# EAGLE design new_9DOF (EAGLE 7.1.0)
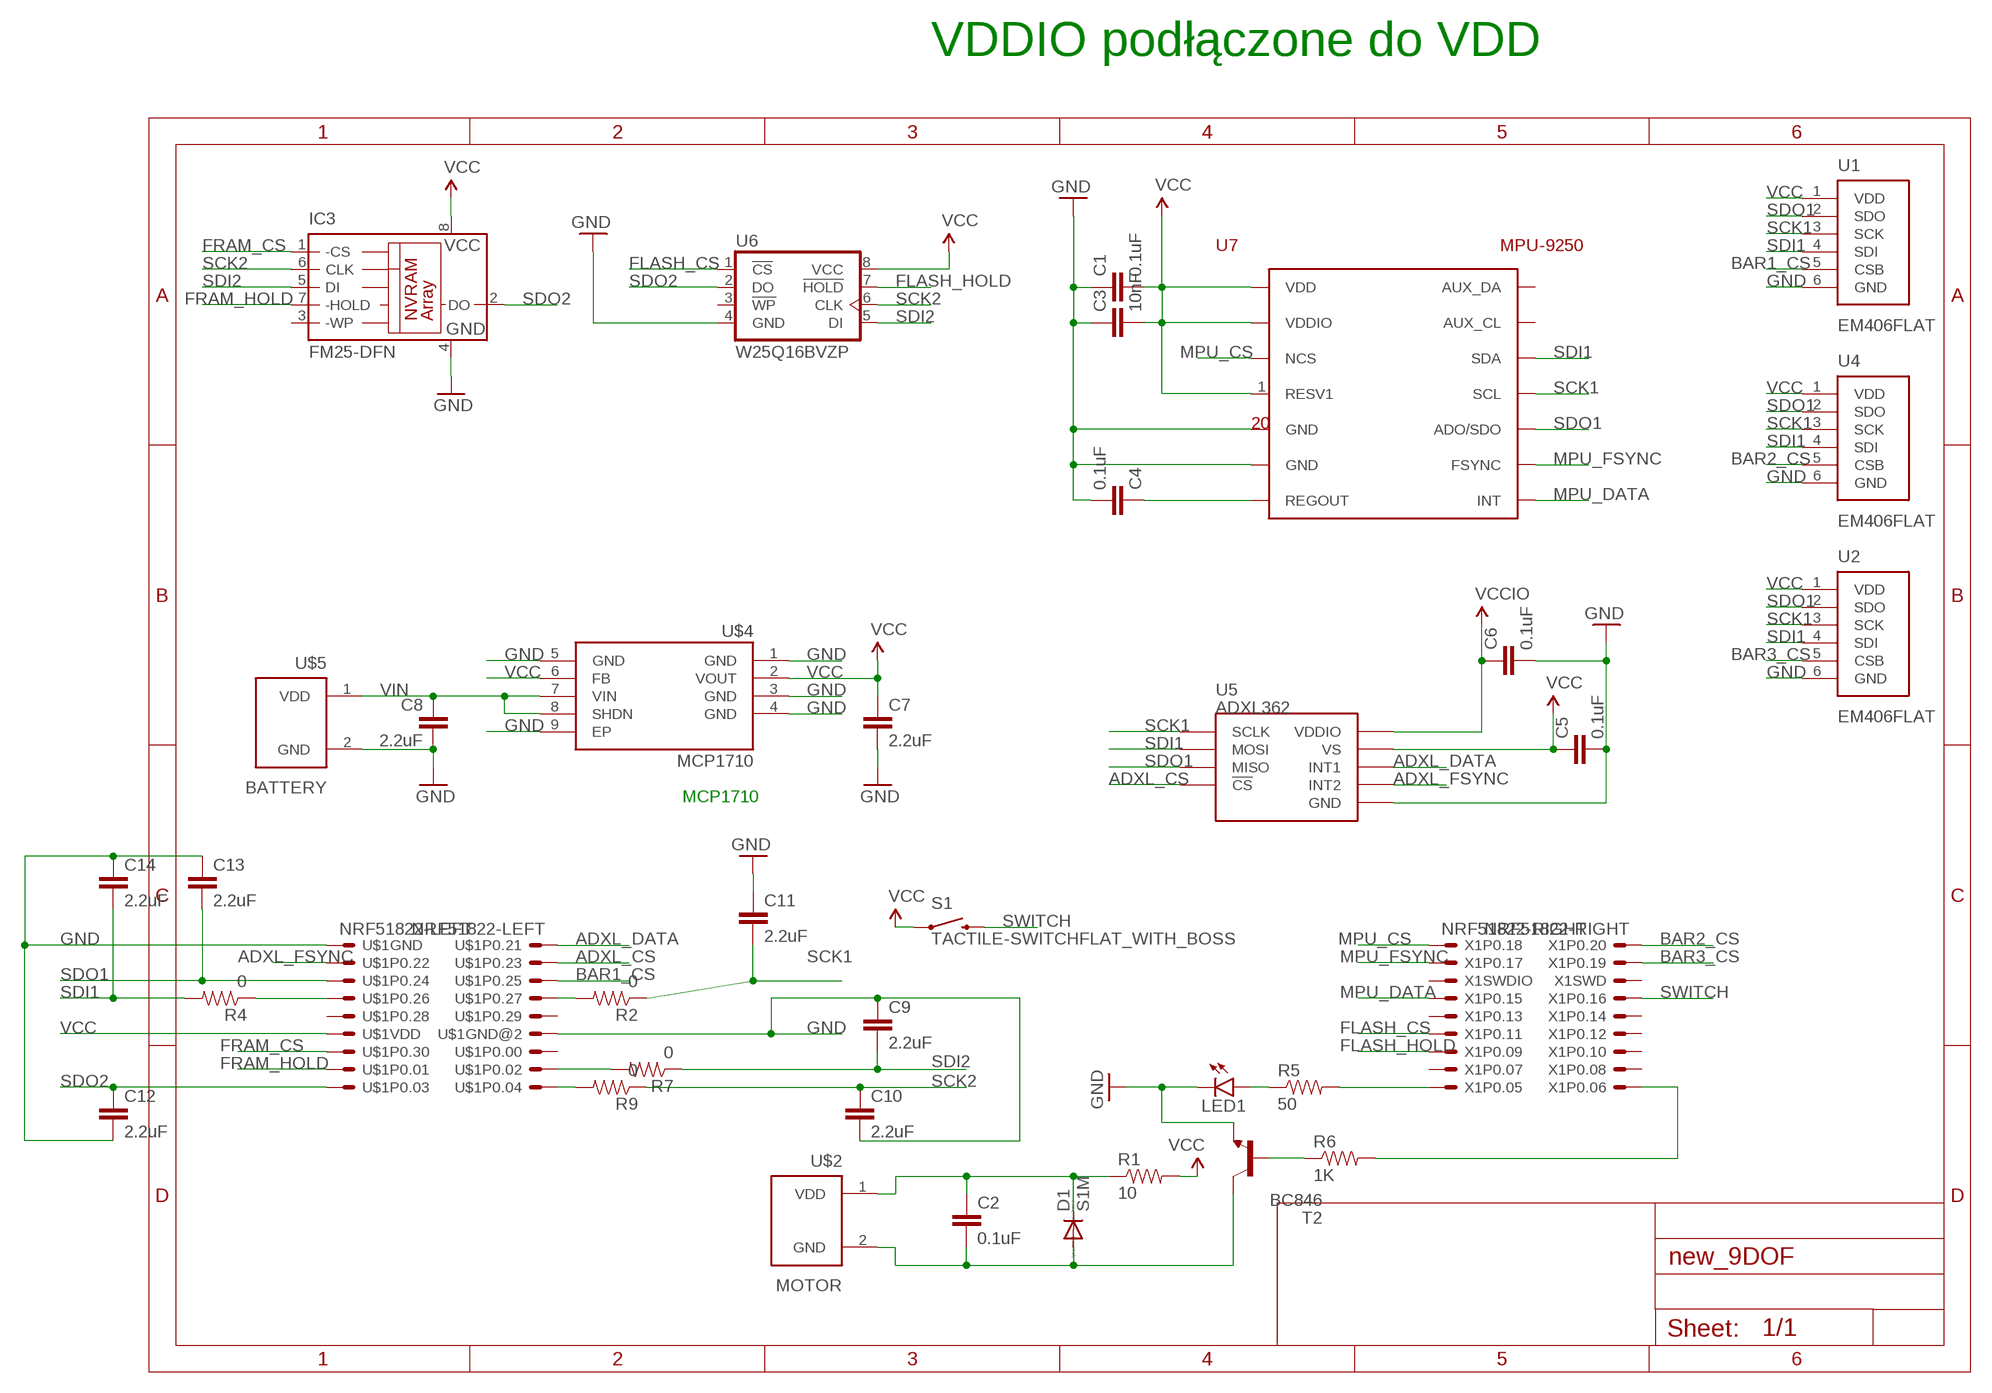
[diagram p0: schematic, sheet 1]

## Parts
C1  0.1uF  0.1UF-25V(+80/-20%)(0603)  [0603-CAP]
C2  0.1uF  0.1UF-25V(+80/-20%)(0603)  [0603-CAP]
C3  10nF  0.1UF-25V(+80/-20%)(0603)  [0603-CAP]
C4  0.1uF  0.1UF-25V(+80/-20%)(0603)  [0603-CAP]
C5  0.1uF  0.1UF-25V(+80/-20%)(0603)  [0603-CAP]
C6  0.1uF  0.1UF-25V(+80/-20%)(0603)  [0603-CAP]
C7  2.2uF  0.1UF-25V(+80/-20%)(0603)  [0603-CAP]
C8  2.2uF  0.1UF-25V(+80/-20%)(0603)  [0603-CAP]
C9  2.2uF  0.1UF-25V(+80/-20%)(0603)  [0603-CAP]
C10  2.2uF  0.1UF-25V(+80/-20%)(0603)  [0603-CAP]
C11  2.2uF  0.1UF-25V(+80/-20%)(0603)  [0603-CAP]
C12  2.2uF  0.1UF-25V(+80/-20%)(0603)  [0603-CAP]
C13  2.2uF  0.1UF-25V(+80/-20%)(0603)  [0603-CAP]
C14  2.2uF  0.1UF-25V(+80/-20%)(0603)  [0603-CAP]
D1  S1M  [SMA]
IC3  FM25-DFN  [DFN-8]
LED1  LED0603  [LED-0603]
R1  10  1KOHM1/10W1%(0603)  [0603-RES]
R2  0  100OHM1/10W1%(0603)  [0603-RES]
R4  0  100OHM1/10W1%(0603)  [0603-RES]
R5  50  100OHM1/10W1%(0603)  [0603-RES]
R6  1K  1KOHM1/10W1%(0603)  [0603-RES]
R7  0  100OHM1/10W1%(0603)  [0603-RES]
R9  0  100OHM1/10W1%(0603)  [0603-RES]
S1  TACTILE-SWITCHFLAT_WITH_BOSS  [TACTILE-SWITCH-SMD]
T2  BC846  [SOT23]
U1  EM406FLAT  [EM406-FLAT]
U2  EM406FLAT  [EM406-FLAT]
U4  EM406FLAT  [EM406-FLAT]
U5  ADXL362  ADXL362ADXL362-1:1  [ADXL362-1:1]
U6  W25Q16BVZP  [WSON8]
U7  MPU-9250  [MPU-9250]
U$1  NRF51822-LEFT  [NRF51822-LEFT]
U$2  MOTOR  EM406-2PINFLAT  [EM406-2PIN]
U$4  MCP1710  [MCP1710]
U$5  BATTERY  EM406-2PINFLAT  [EM406-2PIN]
X1  NRF51822-RIGHT  [NRF51822-RIGHT]

## Nets
ADXL_CS: U5.P$8(!CS) U$1.4
ADXL_DATA: U5.P$11(INT1) U$1.2
ADXL_FSYNC: U5.P$9(INT2) U$1.3
BAR1_CS: U1.5(CSB) U$1.6
BAR2_CS: U4.5(CSB) X1.2
BAR3_CS: U2.5(CSB) X1.4
FLASH_CS: U6.1(!CS!) X1.11
FLASH_HOLD: U6.7(!HOLD!) X1.13
FRAM_CS: IC3.1(-CS) U$1.13
FRAM_HOLD: IC3.7(-HOLD) U$1.15
GND: C1.1 C3.1 C4.2 C5.2 C6.2 C7.2 C8.2 C9.1 C10.2 C11.1 C12.2 C13.1 C14.1 IC3.4(GND) LED1.C T2.2(E) U1.6(GND) U2.6(GND) U4.6(GND) U5.P$12(GND) U5.P$13(GND) U5.P$16(GND) U6.4(GND) U7.18(GND) U7.20(GND) U$1.1 U$1.12 U$4.1(GND) U$4.3(GND) U$4.4(GND) U$4.5(GND) U$4.9(EP) U$5.2(GND)
MPU_CS: U7.22(NCS) X1.1
MPU_DATA: U7.12(INT) X1.7
MPU_FSYNC: U7.11(FSYNC) X1.3
N$1: C4.1 U7.10(REGOUT)
N$2: C2.1 D1.C R1.1 U$2.1(VDD)
N$3: R4.1 U$1.7
N$4: R2.2 U$1.8
N$5: R7.2 U$1.16
N$6: R5.2 X1.17
N$8: R9.2 U$1.18
N$13: LED1.A R5.1
N$14: C2.2 D1.A T2.3(C) U$2.2(GND)
N$15: R6.2 X1.18
N$16: R6.1 T2.1(B)
SCK1: C11.2 R2.1 U1.3(SCK) U2.3(SCK) U4.3(SCK) U5.P$4(SCLK) U7.23(SCL)
SCK2: C10.1 IC3.6(CLK) R9.1 U6.6(CLK)
SDI1: C14.2 R4.2 U1.4(SDI) U2.4(SDI) U4.4(SDI) U5.P$6(MOSI) U7.24(SDA)
SDI2: C9.2 IC3.5(DI) R7.1 U6.5(DI)
SDO1: C13.2 U1.2(SDO) U2.2(SDO) U4.2(SDO) U5.P$7(MISO) U7.9(ADO/SDO) U$1.5
SDO2: C12.1 IC3.2(DO) U6.2(DO) U$1.17
SWITCH: S1.2 X1.8
VCC: C1.2 C3.2 C5.1 C7.1 IC3.8(VCC) R1.2 S1.1 U1.1(VDD) U2.1(VDD) U4.1(VDD) U5.P$14(VS) U6.8(VCC) U7.1(RESV1) U7.8(VDDIO) U7.13(VDD) U$1.11 U$4.2(VOUT) U$4.6(FB)
VCCIO: C6.1 U5.P$1(VDDIO)
VIN: C8.1 U$4.7(VIN) U$4.8(SHDN) U$5.1(VDD)
Unconnected: IC3.3(-WP) U6.3(!WP!) U7.7(AUX_CL) U7.21(AUX_DA) U$1.9 U$1.10 U$1.14 X1.5 X1.6 X1.9 X1.10 X1.12 X1.14 X1.15 X1.16

## Notes on the sheet
- VDDIO podłączone do VDD
- MCP1710

## Library data of the parts
C1 C2 C4-C6 = SparkFun-Capacitors:0.1UF-25V(+80/-20%)(0603): CAP-00810 Ceramic Standard decoupling cap; PROD_ID: CAP-00810
C3 C7-C14 = SparkFun-Capacitors:0.1UF-25V(+80/-20%)(0603): CAP-00810 Ceramic Standard decoupling cap; PROD_ID: CAP-00810; VALUE: 0.1uF
D1 = icarus_sensors:S1M
IC3 = icarus_sensors:FM25*: SPI Serial NVRAM
LED1 = SparkFun-LED:LED: LEDs Standard schematic elements and footprints for 5mm, 3mm, 1206, and 0603 sized LEDs. 5mm - Spark Fun Electronics SKU : COM-00529 (and others)
R1 = SparkFun-Resistors:1KOHM1/10W1%(0603): RES-07856; PROD_ID: RES-07856; VALUE: 1K
R2 R4 R5 R7 R9 = SparkFun-Resistors:100OHM1/10W1%(0603): RES-07863; PROD_ID: RES-07863; VALUE: 100
R6 = SparkFun-Resistors:1KOHM1/10W1%(0603): RES-07856; PROD_ID: RES-07856
S1 = icarus_sensors:TACTILE-SWITCH: OMRON B3U-3000P(M)-B momentary switch
T2 = icarus_sensors:BC846: NPN TRANSISTOR
U1 U2 U4 = icarus_sensors:EM406: EM406 GPS Connector Proven layout and schematic for EM406 connector. Spark Fun Electronics SKU : GPS-00579
U5 = icarus_sensors:ADXL362: Micropower 3-axis accelerometer 2/4/8g digital output (SPI) IC-11297
U6 = icarus_sensors:W25Q16BV: EEPROM 4 Mbit SPI Serial Flash7
U7 = icarus_sensors:MPU-9250: The MPU-9250 is a 9-axis motion sensor that contains an accelerometer/gyro sensor (MPU-6500) combined with a magnetometer (AK8963).
U$1 = NRF51822_con_left:NRF51822-LEFT: left connector of NFR518822 board; MPN: NRF51822-left; OC_FARNELL: unknown; OC_NEWARK: 25M5675
U$2 U$5 = icarus_sensors:EM406-2PIN
U$4 = icarus_sensors:MCP1710: MCP1710 Ultra-Low Quiescent Current LDO Regulator 2x2mm
X1 = NRF51822_con_left:NRF51822-RIGHT: right connector of NFR518822 board; MPN: NRF51822-right; OC_FARNELL: unknown; OC_NEWARK: 25M5675

## Board
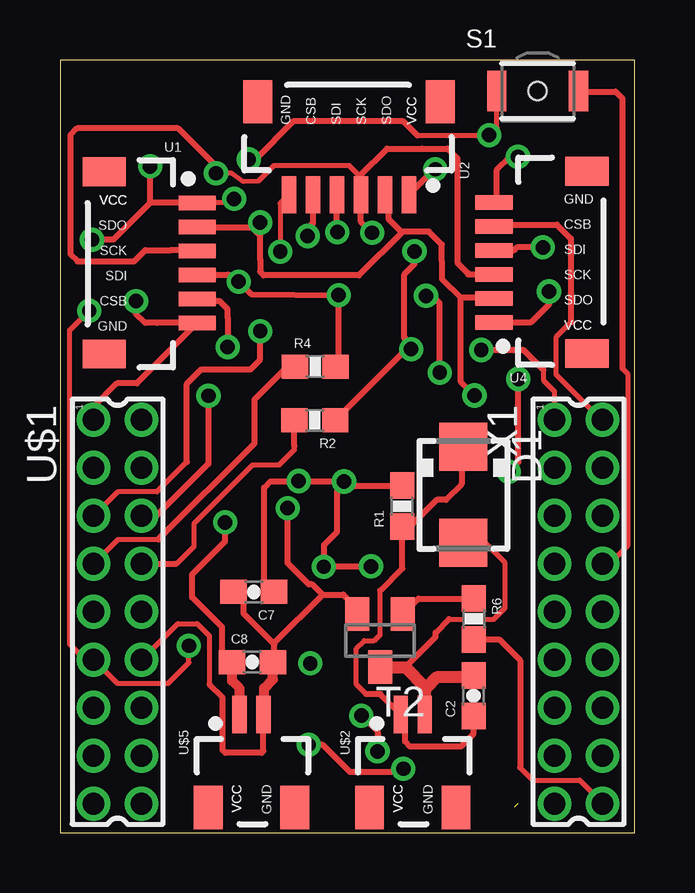
[diagram p1: board, top side]
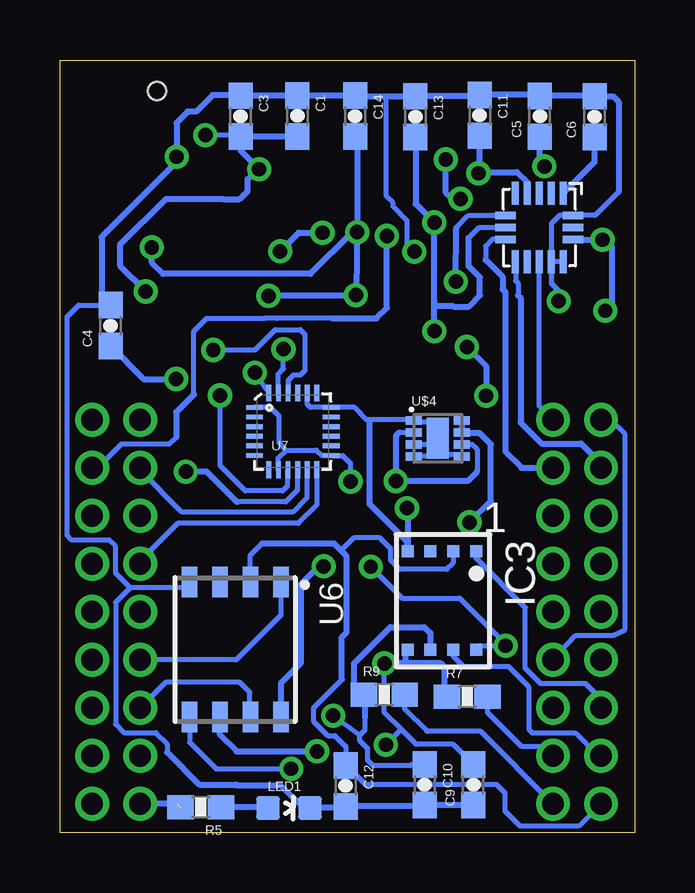
[diagram p2: board, bottom side, seen from below]

Size 23.94 x 32.19 mm. Coordinates in mm from the lower left corner, seen from the top.
Outline: 0,0 23.94,0 23.94,32.19 0,32.19 0,0
Copper layers (1*16): Top 0.035mm / dielectric 1.5mm / Bottom 0.035mm
Design rules "default": minimum track width 10mil, minimum drill 24mil, track to track 8mil, track to pad 8mil, pad to pad 8mil, via to via 8mil, smd to smd 8mil, copper to edge 40mil, drill to drill 8mil, minimum pad ring 10mil, minimum via ring 8mil, stop-mask expansion 4mil, vias tented up to drill 0mil, thermal gap 10mil

### Footprints (pad centres in the part's own frame; a part is rotated, then mirrored left to right if it is on the bottom)
0603-CAP = smd 1.1 x 1: 1 -0.85,0; 2 0.85,0
SMA = smd 2 x 2: A 2,0; C -2,0
DFN-8 = smd 0.5 x 0.5: 1 -1.425,-2.05; 2 -0.475,-2.05; 3 0.475,-2.05; 4 1.425,-2.05; 5 1.425,2.05; 6 0.475,2.05; 7 -0.475,2.05; 8 -1.425,2.05
LED-0603 = smd 1 x 1: A 0,-0.877; C 0,0.877
0603-RES = smd 1.1 x 1: 1 -0.85,0; 2 0.85,0
TACTILE-SWITCH-SMD = smd 0.8 x 1.7: 1 -1.7,0; 2 1.7,0 | hole 0.75: 0,0
SOT23 = smd 1 x 1.4: 1 -0.95,-1.1; 2 0.95,-1.1; 3 0,1.1
EM406-FLAT = smd 0.6 x 1.55: 1 -2.54,2.92; 2 -1.54,2.92; 3 -0.54,2.92; 4 0.46,2.92; 5 1.46,2.92; 6 2.46,2.92 | smd 1.2 x 1.8: P$1 -3.84,-0.955; P$2 3.76,-0.955
ADXL362-1:1 = smd 0.952 x 0.3: P$1 -1.426,1; P$2 -1.426,0.5; P$3 -1.426,0; P$4 -1.426,-0.5; P$5 -1.426,-1; P$9 1.426,-1; P$10 1.426,-0.5; P$11 1.426,0; P$12 1.426,0.5; P$13 1.426,1 | smd 0.3 x 0.851: P$6 -0.5,-1.402; P$7 0,-1.402; P$8 0.5,-1.402; P$14 0.5,1.402; P$15 0,1.402; P$16 -0.5,1.402
WSON8 = smd 0.635 x 1.27: 1 -1.905,-2.81; 2 -0.635,-2.81; 3 0.635,-2.81; 4 1.905,-2.81; 5 1.905,2.81; 6 0.635,2.81; 7 -0.635,2.81; 8 -1.905,2.81
MPU-9250 = smd 0.7 x 0.2: 1 -1.6,1; 2 -1.6,0.6; 3 -1.6,0.2; 4 -1.6,-0.2; 5 -1.6,-0.6; 6 -1.6,-1; 13 1.6,-1; 14 1.6,-0.6; 15 1.6,-0.2; 16 1.6,0.2; 17 1.6,0.6; 18 1.6,1 | smd 0.2 x 0.7: 7 -1,-1.6; 8 -0.6,-1.6; 9 -0.2,-1.6; 10 0.2,-1.6; 11 0.6,-1.6; 12 1,-1.6; 19 1,1.6; 20 0.6,1.6; 21 0.2,1.6; 22 -0.2,1.6; 23 -0.6,1.6; 24 -1,1.6
NRF51822-LEFT = drill 0.9 pad 1.27: 1 -8,-1; 2 -8,1; 3 -6,-1; 4 -6,1; 5 -4,-1; 6 -4,1; 7 -2,-1; 8 -2,1; 9 0,-1; 10 0,1; 11 2,-1; 12 2,1; 13 4,-1; 14 4,1; 15 6,-1; 16 6,1; 17 8,-1; 18 8,1
EM406-2PIN = smd 0.6 x 1.55: 1 -2.54,2.92; 2 -1.54,2.92 | smd 1.2 x 1.8: P$1 -3.84,-0.955; P$2 -0.24,-0.955
MCP1710 = smd 0.35 x 0.65: 1 0,-2; 2 0.5,-2; 3 1,-2; 4 1.5,-2; 5 1.5,0; 6 1,0; 7 0.5,0; 8 0,0 | smd 1.7 x 0.9: 9 0.75,-1
NRF51822-RIGHT = drill 0.9 pad 1.27: 1 -8,-1; 2 -8,1; 3 -6,-1; 4 -6,1; 5 -4,-1; 6 -4,1; 7 -2,-1; 8 -2,1; 9 0,-1; 10 0,1; 11 2,-1; 12 2,1; 13 4,-1; 14 4,1; 15 6,-1; 16 6,1; 17 8,-1; 18 8,1

### Placement (x,y rotation side)
C1  14.05,29.86 270 bottom
C2  17.24,5.7 90 top
C3  16.42,29.85 270 bottom
C4  21.83,21.12 90 bottom
C5  3.95,29.84 90 bottom
C6  1.66,29.83 90 bottom
C7  8.07,10.03 180 top
C8  8.02,7.1 0 top
C9  6.72,1.99 90 bottom
C10  8.75,1.99 270 bottom
C11  6.45,29.88 270 bottom
C12  12.04,1.94 270 bottom
C13  9.14,29.83 270 bottom
C14  11.64,29.85 270 bottom
D1  16.81,14.07 270 top
IC3  8.03,9.67 180 bottom
LED1  14.4,1.02 270 bottom
R1  14.26,13.6 90 top
R2  10.62,17.18 180 top
R4  10.63,19.42 0 top
R5  18.07,1.06 180 bottom
R6  17.24,8.9 270 top
R7  6.97,5.67 0 bottom
R9  10.43,5.75 0 bottom
S1  19.9,30.9 0 top
T2  13.34,8 180 top
U1  2.8,23.7 270 top
U2  12,29.5 180 top
U4  21,23.8 90 top
U5  3.97,25.21 270 bottom
U6  16.64,7.62 180 bottom
U7  14.24,16.71 0 bottom
U$1  2.4,9.2 270 top
U$2  16.74,2 0 top
U$4  7.2,17.18 270 bottom
U$5  10.02,2 0 top
X1  21.6,9.2 270 top

### Tracks (layer width: path | path; a pad name or v marks a point on that pad's centre or on a via)
ADXL_CS
  Bottom 0.203: U5.P$8 5.93,24.71 6.21,24.43 6.21,23.86
  Bottom 0.254: U$1.4 4.71,15.2 5.38,15.88 5.38,22.52 5.5,22.63 5.5,23.15 6.21,23.86
ADXL_DATA
  Bottom 0.203: U5.P$11 3.98,17.77 U$1.2
ADXL_FSYNC
  Bottom 0.203: U5.P$9 4.95,23.77 4.95,22.99 4.85,22.89 4.85,22.38
  Bottom 0.254: 4.85,22.38 4.75,22.28 4.75,17.08 3.87,16.2 2.22,16.2 1.4,15.38 U$1.3
BAR1_CS  (via drill 0.6)
  Top 0.254: U$1.6 4.02,13.2 6.18,15.37 v6.18,18.2 | 5.69,22.21 5.76,22.15 6.64,22.15 6.99,21.8 6.99,21.47 6.99,21.46 v6.99,20.23
  Top 0.406: U1.5 5.69,22.21
  Bottom 0.254: v6.99,20.23 6.18,19.43 v6.18,18.2
BAR2_CS
  Top 0.203: 21.29,21.26 20.66,20.64 20.66,19.09 22.55,17.2 X1.2
  Top 0.254: 18.11,25.23 18.2,25.33 20.7,25.33 21.29,24.74 21.29,21.26
  Top 0.406: U4.5 18.11,25.23
BAR3_CS  (via drill 0.6)
  Top 0.254: U2.5 10.53,25.38 10.32,25.17 v10.32,24.86
  Bottom 0.203: 19.1,16.46 19.38,16.18 21.39,16.18 22.37,15.2 X1.4 | 12.59,21.42 14.89,21.42 15.42,21.42 17.83,21.42 18.36,20.89 18.36,18.25
  Bottom 0.254: 19.1,16.46 19.1,17.51 18.36,18.25 | 12.59,21.42 10.75,21.42 10.32,21.85 v10.32,24.86
FLASH_CS
  Bottom 0.203: U6.1 14.74,9.06 16.6,7.2 X1.11
FLASH_HOLD
  Bottom 0.203: U6.7 16.03,4.84 16.03,5.84 16.45,6.25 19.54,6.25 X1.13
FRAM_CS
  Bottom 0.203: U$1.13 1.4,5.57 2.05,6.21 3.93,6.21 4.57,6.86 4.55,6.88 4.55,9.38 6.61,11.43 IC3.1
FRAM_HOLD
  Bottom 0.203: U$1.15 1.53,3.2 2.48,4.16 4.27,4.16 4.39,4.28 4.39,6.05 5.25,6.91 7.11,6.91 7.56,7.35 IC3.7
GND  (via drill 0.6)
  Top 0.203: U2.6 9.18,26.22 v9.18,24.21 | U$1.12 4.91,8.71 5.71,8.71 6.23,8.2 6.23,6.18
  Top 0.254: U2.6 9.53,26.57 | U1.6 3.2,18.72 2.38,18.72 1.4,17.75 U$1.1 | U1.6 4.04,21.23 3.55,21.23 3.17,21.62 v3.17,22.14 | C8.2 9.02,7.25 8.93,7.34 8.93,7.85 | U4.6 18.27,26.45 18.2,26.51 18.2,27.61 18.75,28.16 v19.08,28.16 | 12.39,9.22 T2.2 12.39,9.33 11.81,9.91 10.94,9.91 | 8.93,7.85 8.93,7.9 10.94,9.91 | C7.2 7.64,9.61 7.64,9.13 8.93,7.85 | 10.94,9.91 10.51,10.34 10.37,10.34 9.48,11.23 v9.48,13.52 | U$5.2 8.48,3.4 8.39,3.31 8.39,3.32 6.9,3.32 6.78,3.44 6.78,5.63 6.23,6.18
  Top 0.406: U1.6 | U$5.2 8.51,4.95 8.51,6.02 8.87,6.38 C8.2
  Bottom 0.203: U5.P$12 3.47,25.37 3.12,25.72 U5.P$16 1.64,25.71 0.66,26.7 | U5.P$13 U5.P$12 | U$1.12 2.44,8.21 0.9,8.21 0.39,8.46 0.39,16.59 1.01,17.2 U$1.1 | U7.20 13.64,17.84 13.5,17.71 U7.18 11.66,17.71 11.15,17.2 11.04,17.2 9.22,17.2 U$4.1 9.14,17.11 8.45,17.11 8.2,16.87 U$4.9 | U6.4 18.78,10.2 21.01,10.2 | 21.01,10.2 21.62,9.59 21.62,4.51 21.27,4.16 19.95,4.16 19.47,3.69 19.47,3.34 | v9.18,24.21 9.47,24.5 9.47,25.5 10.06,26.09 10.06,26.24 10.34,26.52 10.34,30.68 | 21.01,10.2 21.62,10.81 21.62,11.93 21.88,12.19 23.45,12.19 23.65,12.38 23.65,21.49 23.16,21.97 C4.2 | U$4.5 7.27,15.75 7.88,15.75 8.2,16.07 U$4.9 | U$4.3 8.2,16.18 U$4.9 | U$4.4 9.18,15.7 8.53,15.7 8.2,16.03 U$4.9 | U5.P$12 3.46,22.88 3.17,22.58 v3.17,22.14
  Bottom 0.254: 0.66,26.7 0.66,30.44 0.89,30.67 C6.2 1.68,30.69 C5.2 3.98,30.73 C11.1 6.51,30.68 C13.1 10.34,30.68 11.62,30.68 C14.1 C1.1 C3.1 16.44,30.72 17.58,30.72 18.27,30.04 18.62,30.04 19.08,29.57 v19.08,28.16 19.09,28.15 19.09,27.93 22.2,24.82 22.2,22.43 21.83,22.05 C4.2 21.87,22.02 | C9.1 6.75,1.11 6.78,1.14 C10.2 8.8,1.09 C12.2 12.11,1.02 LED1.C 13.8,1.02 14.76,1.98 16.59,1.98 16.6,2 18.13,2 19.47,3.34 | 11.04,17.2 11.04,13.69 9.46,12.11 IC3.4 9.46,13.49 v9.48,13.52
MPU_CS  (via drill 0.6)
  Top 0.203: 20.6,17.4 X1.1 20.6,18.39 20.14,18.85 20.14,19.28
  Top 0.254: 20.14,19.28 19.32,20.1 v17.55,20.1
  Bottom 0.203: 14.44,18.72 U7.22 14.44,18.84 14.22,19.06 13.93,19.06 13.74,19.24 13.74,20.77 13.92,20.95 14.97,20.95 15.82,20.1 v17.55,20.1 17.49,20.1
MPU_DATA
  Bottom 0.203: U7.12 13.25,13.64 14.01,12.88 19.04,12.88 20.6,11.31 X1.7
MPU_FSYNC
  Bottom 0.203: U7.11 13.65,15.1 13.65,13.95 14.25,13.35 18.86,13.35 20.6,15.09 X1.3
N$1  (via drill 0.6)
  Top 0.254: v18.69,15.04 19.1,15.44 v19.1,18.9
  Bottom 0.203: U7.10 14.05,14.26 14.53,13.78 16.57,13.78
  Bottom 0.254: C4.1 20.45,18.9 v19.1,18.9 | 16.57,13.78 17.83,15.04 v18.69,15.04
N$2
  Top 0.203: 12.75,5.77 12.35,6.17 12.35,7.67 12.67,7.99 13.09,7.99 13.34,8.24 13.34,10.08
  Top 0.254: U$2.1 | C2.1 17.24,4.12 16.7,3.58 14.58,3.58 14.38,3.79 14.38,4.34 14.2,4.52 U$2.1 | U$2.1 13.35,5.77 12.75,5.77 | D1.C 16.74,16 16.74,14.52 16.08,13.86 15.7,13.86 14.59,12.75 R1.1 14.26,11.01 13.34,10.08
N$3
  Top 0.203: U$1.7 2.42,12.22 4.1,12.22
  Top 0.254: R4.1 9.47,19.42 8.11,18.05 8.11,16.22 4.1,12.22
N$4
  Top 0.203: 4.86,11.2 5.59,11.93 5.59,12.88 8.03,15.32 9.14,15.32 9.77,15.94 9.77,16.11
  Top 0.254: U$1.8 4.86,11.2 | 9.77,16.11 R2.2
N$5
  Bottom 0.203: U$1.16 3.78,3.58 4.69,3.58 6.12,5 R7.2
N$6  (1 unrouted)
  Bottom 0.254: 19.06,1.2 X1.17
N$8
  Bottom 0.203: U$1.18 6.41,4.21 8.65,4.21 9.58,5.14 R9.2
N$13
  Bottom 0.203: 17.22,1.15 R5.1
  Bottom 0.254: LED1.A 15.31,1.06 R5.1
N$14
  Top 0.203: 16.21,8.89 18.08,8.89 18.54,9.36 18.54,11.24 17.71,12.07 D1.A
  Top 0.254: 14.38,6.88 15.65,8.15 15.65,8.33 16.21,8.89
  Top 0.508: T2.3 13.35,6.88 14.38,6.88 15.2,6.06 | 15.2,6.06 U$2.2 | C2.2 17.15,6.46 15.68,6.46 15.28,6.06 15.2,6.06
N$15
  Top 0.203: 19.18,2.71 19.7,2.18 21.65,2.18 22.6,1.24 X1.18
  Top 0.254: R6.2 18.3,8.05 19.18,7.18 19.18,2.71
N$16
  Top 0.254: T2.1 14.94,9.75 R6.1
SCK1  (via drill 0.6)
  Top 0.203: 12.54,27.3 12.05,27.79 8.91,27.79 8.27,27.14 7.64,27.13 7.16,27.47 v6.5,27.47 | 14.63,20.18 v14.63,20.14
  Top 0.254: U1.3 5.69,24.27 4.62,24.27 | 12.54,27.3 U2.3 | U2.3 12.5,26.62 12.5,27.37 13.63,28.5 15.09,28.5 16.15,28.5 16.56,28.09 16.56,23.74 17,23.31 17,23.26 U4.3 | 6.5,27.74 v6.5,27.47 | 4.62,24.27 4.61,24.26 | 6.5,27.42 v6.5,27.47 | 4.62,24.27 3.56,24.27 3.09,23.8 0.74,23.8 0.43,24.11 0.43,29.06 0.71,29.34 4.92,29.34 6.5,27.75 v6.5,27.47 | v13.01,24.99 12.54,25.46 U2.3 | R2.1 14.43,20.14 v14.63,20.14 14.63,20.33 14.33,20.63 14.35,20.65 14.35,23.26 14.77,23.68 v14.77,24.22
  Bottom 0.203: U7.23 14.85,18.32 14.85,19.1 14.63,19.32 v14.63,20.14
  Bottom 0.254: v6.5,27.47 6.45,27.52 | 6.45,27.52 C11.2 | 6.45,27.52 4.9,27.52 4.47,27.09 U5.P$4 | v14.77,24.22 13.99,24.99 v13.01,24.99
SCK2  (via drill 0.6)
  Top 0.254: v12.56,4.87 13.23,4.2 v13.23,3.39
  Bottom 0.203: R9.1 11.25,5.72 11.25,4.26 11.45,4.06 | 11.45,4.06 v12.56,4.87 | C10.1 9.29,2.84 9.34,2.79 10.89,2.79 11.12,3.01 11.12,3.49 11.45,3.82 11.45,4.06
  Bottom 0.254: R9.1 11.24,5.71 11.24,4.79 | R9.1 | R9.1 11.7,6.17 11.7,7.04 10.18,8.56 8.76,8.56 8.51,8.31 IC3.6 | v13.23,3.39 16.58,3.39 17.27,4.08 U6.6
SDI1  (via drill 0.6)
  Top 0.254: 5.73,23.23 U1.4 5.74,23.22 5.78,23.25 7.01,23.25 7.3,22.96 v7.45,22.96 7.96,22.44 v11.61,22.39 11.61,19.55 R4.2 | v11.56,25.02 11.54,25.04 U2.4 | U4.4 18.92,24.27 19.04,24.38 v20.12,24.38 | v15.82,19.16 15.82,19.38 15.82,22.05 15.51,22.36 v15.25,22.36
  Bottom 0.203: 7.43,25.21 6.93,25.71 U5.P$6 | U7.24 v15.82,19.16 | v15.25,22.36 15.23,22.39
  Bottom 0.254: v11.56,25.02 11.56,23.46 v11.61,22.39 11.64,22.36 v15.25,22.36 | v11.56,25.02 11.76,25.02 13.51,23.27 19.65,23.27 20.12,23.74 v20.12,24.38 | C14.2 11.56,28.92 v11.56,25.02 | v7.45,22.96 7.43,25.21
SDI2  (via drill 0.6)
  Top 0.254: 10.37,3.65 v10.36,3.66 10.95,3.66 12.09,2.52 14.17,2.52 v14.31,2.66
  Bottom 0.203: C9.2 7.55,3.68 9.11,3.68 9.72,4.3 | 9.72,4.3 10.43,5 10.43,6.59 10.43,6.6 v10.43,7.05 | U6.5 18.53,4.8 18.53,3.76 17.43,2.66 v14.31,2.66 | v10.36,3.66 9.72,4.3
  Bottom 0.254: R7.1 7.9,5.75 7.9,6.9 8.06,7.05 9.55,7.05 | 9.55,7.05 v10.43,7.05 | IC3.5 9.55,7.52 9.55,7.05
SDO1  (via drill 0.6)
  Top 0.203: U$1.5 2.4,14.2 4.04,14.2 5.28,15.44
  Top 0.254: U1.2 5.76,25.22 7.92,25.22 | U4.2 18.06,22.28 16.7,22.28 | 5.28,15.44 5.28,18.69 5.89,19.3 7.11,19.3 7.12,19.3 7.94,19.3 8.34,19.71 v8.34,20.89 | 16.7,22.28 15.91,23.06 15.91,23.8 15.91,24.5 15.37,25.04 14.27,25.04 | v17.27,18.21 16.7,18.78 16.7,22.28 | v8.34,25.42 7.92,25.22 | 7.94,25.29 8.08,25.15 | 8.08,25.15 8.33,24.89 8.33,23.9 8.34,23.89 8.34,23.37 8.49,23.22 12.46,23.22 14.27,25.04 | U2.2 13.68,26.44 13.68,25.58 14.22,25.04 14.27,25.04 | 7.92,25.22 8.08,25.22 8.08,25.15
  Bottom 0.203: U7.9 14.46,15.09 14.46,14.44 14.67,14.24 16.22,14.24 17.27,15.29 v17.27,18.21 | 8.78,25.86 8.57,25.66 | 6.91,24.77 6.47,25.21 U5.P$7
  Bottom 0.254: C13.2 9.12,28.96 9.12,26.2 8.78,25.86 8.36,25.44 v8.34,25.42 8.34,22.13 8.34,21.92 | v8.34,20.89 8.34,21.92 | 8.34,21.92 7.54,21.92 6.91,21.92 6.44,22.38 6.44,23.14 6.91,23.6 6.91,24.77
SDO2
  Bottom 0.203: U$1.17 2.33,0.27 4.77,0.27 5.39,0.89 5.39,1.65 5.74,2 11.2,2 12,2.79 C12.1 | U6.2 16.01,10.44 16.01,11.56 15.53,12.04 | C12.1 12.45,3.2 | 12.2,6.38 13.39,5.18 13.39,4.65 12.78,4.04 12.49,4.04 12.07,3.62 12.06,3.62 12.04,3.6 C12.1 | IC3.2 7.56,11.22 7.82,10.96 9.77,10.96 10.16,11.35 10.16,11.83 10.61,12.28 11.71,12.28 12.21,11.78 12.21,11.73
  Bottom 0.254: 12.2,6.38 12.2,8.15 11.99,8.35 11.99,11.51 12.21,11.73 12.52,12.04 15.53,12.04
SWITCH
  Top 0.203: 23.43,19.34 23.65,19.13 23.65,11.94 22.91,11.2 X1.8
  Top 0.254: S1.2 21.63,30.87 23.15,30.87 23.43,30.59 23.43,19.34
VCC  (via drill 0.6)
  Top 0.203: v7.25,26.4 7.09,26.24 U1.1 | S1.1 18.2,29.38 v17.88,29.06 14.88,29.06 14.31,29.63 | v5.37,7.79 5.37,7.08 4.5,6.21 2.39,6.21 U$1.11 1.06,7.2 0.39,7.87 0.39,20.92 v1.22,21.74
  Top 0.254: U1.1 5.66,26.3 5.59,26.24 3.76,26.24 | 3.76,26.24 2.22,24.7 v1.33,24.7 | U2.1 15.31,27.35 v15.64,27.64 | 3.76,26.24 v3.76,27.76 | 14.89,29.05 14.31,29.63 9.73,29.63 8.14,28.04 v7.87,28.04 | U4.1 19.64,21.27 20.37,22 v20.37,22.55 | v12.95,11.09 v12.96,11.09 10.89,11.09 10.9,11.08 v10.99,11.08 | v11.84,14.63 12.01,14.45 R1.2 | 11.69,14.63 v11.84,14.63 | 10.99,10.99 v10.99,11.08 | 10.94,11.08 v10.99,11.08 | v10.99,11.08 10.99,11.98 11.55,12.54 11.55,14.21 11.84,14.5 v11.84,14.63 | 9.08,9.87 C7.1 8.51,10.44 8.51,14.37 8.77,14.63 9.95,14.63 | 9.95,14.63 v11.84,14.63 | v9.94,14.65 9.94,14.63 9.95,14.63
  Bottom 0.203: U7.8 14.85,15.12 14.85,15.61 14.52,15.94 | 14.52,15.94 13.26,15.94 13.03,15.71 U7.13 12.15,15.71 11.84,15.39 v11.84,14.63 | 7.6,26.4 v7.25,26.4 | C3.2 16.48,29.06 v17.88,29.06 | 14.52,15.94 14.81,16.24 14.81,17.35 15.18,17.71 U7.1 | v10.99,11.08 9.68,9.77 7.29,9.77 5.81,8.29 v5.37,7.79 6.44,7.79 IC3.8 | U$4.6 | U$4.6 6.75,16.18 6.56,15.98 6.57,15.97 6.56,15.97 6.56,15.04 | 9.8,16.68 U$4.2
  Bottom 0.254: C1.2 14.06,29 C3.2 16.42,28.42 v15.64,27.64 15.71,27.64 16.12,27.23 16.12,26.73 16.45,26.4 17.14,26.4 19.53,26.4 21.45,24.48 21.45,23.62 v20.37,22.55 | v3.76,27.76 3.95,27.95 C5.1 | U6.8 14.73,4.82 14.73,6.24 13.89,7.08 13.89,10.36 13.16,11.09 v12.96,11.09 | v7.87,28.04 7.87,26.67 7.6,26.4 | 6.56,15.04 6.96,14.65 v9.94,14.65 9.94,16.53 9.8,16.68 | U5.P$14 2.56,24.7 v1.33,24.7 | 1.22,24.7 v1.33,24.7 | v1.22,21.74 0.93,22.03 0.93,24.39 1.24,24.7 v1.33,24.7
VCCIO
  Bottom 0.254: U5.P$1 1.66,27.94 C6.1
VIN  (via drill 0.6)
  Top 0.254: 7.02,7.25 C8.1 6.76,7.51 6.76,8.55 5.51,9.8 5.51,10.76 6.88,12.13 v6.88,12.92
  Top 0.406: U$5.1 7.48,6.01 7.17,6.32 C8.1
  Bottom 0.254: U$4.8 U$4.7 7.17,16.65 6.47,16.65 5.99,16.18 5.99,13.81 v6.88,12.92